# Altium schematic sheet genPWM.SchDoc
size 381 x 203 mm
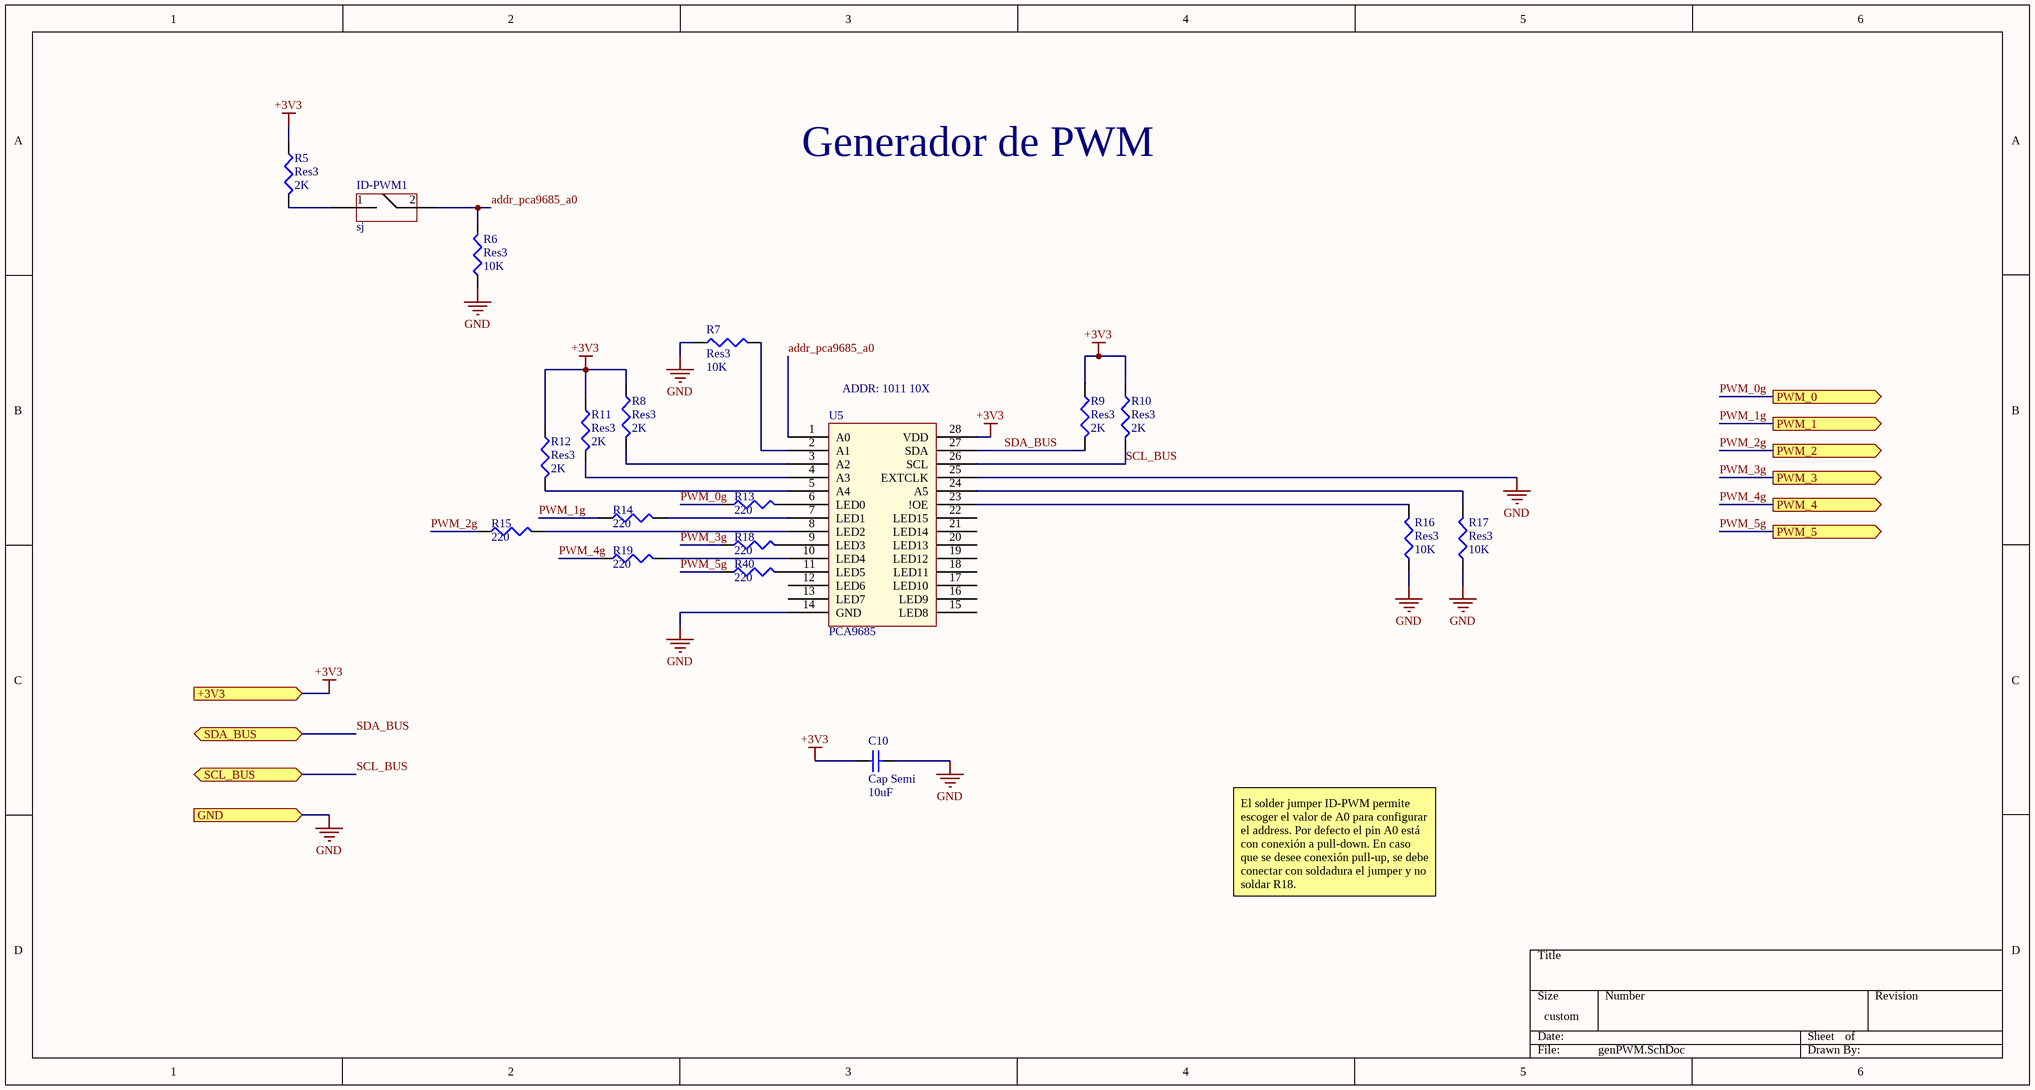
[diagram p0: genPWM.SchDoc]

## Parts
C10  Cap Semi  value 10uF  [1608[0603]]
ID-PWM1  sj  [SJ2]
R5  Res3  value 2K  [J1-0603]
R6  Res3  value 10K  [J1-0603]
R7  Res3  value 10K  [J1-0603]
R8  Res3  value 2K  [J1-0603]
R9  Res3  value 2K  [J1-0603]
R10  Res3  value 2K  [J1-0603]
R11  Res3  value 2K  [J1-0603]
R12  Res3  value 2K  [J1-0603]
R13  value 220  [J1-0603]  (hidden comment: Res3)
R14  value 220  [J1-0603]  (hidden comment: Res3)
R15  value 220  [J1-0603]  (hidden comment: Res3)
R16  Res3  value 10K  [J1-0603]
R17  Res3  value 10K  [J1-0603]
R18  value 220  [J1-0603]  (hidden comment: Res3)
R19  value 220  [J1-0603]  (hidden comment: Res3)
R40  value 220  [J1-0603]  (hidden comment: Res3)
U5  PCA9685  [SSOP-28_L]

## Ports
+3V3 (in), GND (in), PWM_0 (out), PWM_1 (out), PWM_2 (out), PWM_3 (out), PWM_4 (out), PWM_5 (out), SCL_BUS (bidir), SDA_BUS (bidir)

## Nets
+3V3: C10.2 R5.1 R8.1 R9.1 R10.1 R11.1 R12.1 U5.28(VDD) ; port +3V3
GND: C10.1 R6.1 R7.1 R16.1 R17.1 U5.14(GND) U5.25(EXTCLK) ; port GND
addr_pca9685_a0: ID-PWM1.2 R6.2 U5.1(A0)
PWM_0g: R13.1 ; port PWM_0
PWM_1g: R14.1 ; port PWM_1
PWM_2g: R15.1 ; port PWM_2
PWM_3g: R18.1 ; port PWM_3
PWM_4g: R19.1 ; port PWM_4
PWM_5g: R40.1 ; port PWM_5
SCL_BUS: R10.2 U5.26(SCL) ; port SCL_BUS
SDA_BUS: R9.2 U5.27(SDA) ; port SDA_BUS
NetID-PWM1_1: ID-PWM1.1 R5.2
NetR7_2: R7.2 U5.2(A1)
NetR8_2: R8.2 U5.3(A2)
NetR11_2: R11.2 U5.4(A3)
NetR12_2: R12.2 U5.5(A4)
NetR13_2: R13.2 U5.6(LED0)
NetR14_2: R14.2 U5.7(LED1)
NetR15_2: R15.2 U5.8(LED2)
NetR16_2: R16.2 U5.23(!OE)
NetR17_2: R17.2 U5.24(A5)
NetR18_2: R18.2 U5.9(LED3)
NetR19_2: R19.2 U5.10(LED4)
NetR40_2: R40.2 U5.11(LED5)

Not connected (* = marked no-connect by the designer): U5 12(LED6) 13(LED7) 15(LED8) 16(LED9) 17(LED10) 18(LED11) 19(LED12) 20(LED13) 21(LED14) 22(LED15)

## Notes on the sheet
- Generador de PWM
- (near U5) ADDR: 1011 10X
- El solder jumper ID-PWM permite escoger el valor de A0 para configurar el address. Por defecto el pin A0 está con conexión a pull-down. En caso que se desee conexión pull-up, se debe conectar con soldadura el jumper y no soldar R18.

## Library data of the parts
C10 = Cap Semi: Capacitor (Semiconductor SIM Model); Manufacturer: Samsung Electro-Mechanics; Manufacturer Part Number: CL10A106MQ8NNNC; Published: 8-Jun-2000; LatestRevisionDate: 29-May-2009; LatestRevisionNote: IPC-7351 Footprint Added.; PackageReference: C1206; Publisher: Altium Limited; PackageDescription: Chip Capacitor; Supplier 1: LCSC; Supplier Part Number 1: C1691
ID-PWM1 = Jumper: solder jumper generic
R5 R8-R12 = Res3: Resistor; Manufacturer: YAGEO; Manufacturer Part Number: RC0603FR-072KL; Published: 8-Jun-2000; LatestRevisionDate: 29-May-2009; LatestRevisionNote: IPC-7351 Footprint Added.; PackageReference: J1-0603; Publisher: Altium Limited; PackageDescription: Chip Resistor; Supplier 1: LCSC; Supplier Part Number 1: C105576
R6 R7 R16 R17 = Res3: Resistor; Manufacturer: PANASONIC; Manufacturer Part Number: ERJPA3F1002V; Published: 8-Jun-2000; LatestRevisionDate: 29-May-2009; LatestRevisionNote: IPC-7351 Footprint Added.; PackageReference: J1-0603; Publisher: Altium Limited; PackageDescription: Chip Resistor; Supplier 1: LCSC; Supplier Part Number 1: C441927
R13-R15 R18 R19 R40 = Res3: Resistor; Manufacturer Part Number: RC0603FR-07220RL; Manufacturer: YAGEO; Published: 8-Jun-2000; LatestRevisionDate: 29-May-2009; LatestRevisionNote: IPC-7351 Footprint Added.; PackageReference: J1-0603; Publisher: Altium Limited; PackageDescription: Chip Resistor; Supplier 1: LCSC; Supplier Part Number 1: C107696
U5 = PCA9685: LED Drivers,16CH, I2C, TSSOP-28; Manufacturer: NXP Semicon; Manufacturer Part Number: PCA9685PW/Q900,118; Package: TSSOP-28; Supplier 1: LCSC; Supplier Part Number 1: C92206